# EAGLE schematic CAN_Node2pi (EAGLE 7.7.0)
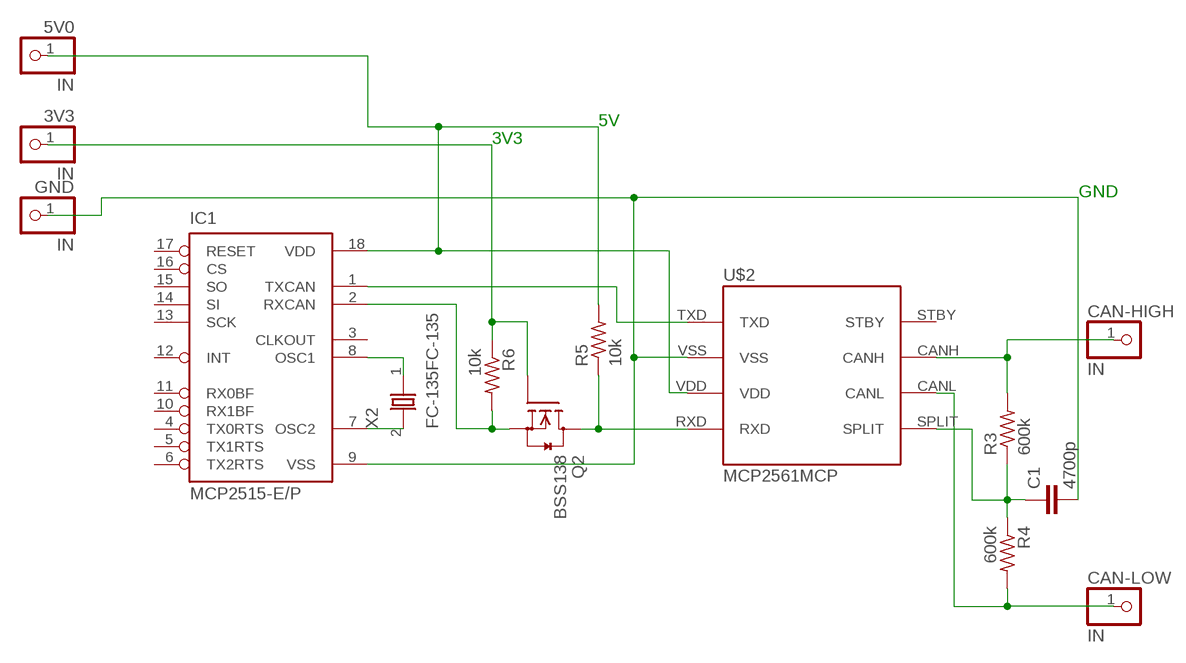
[diagram p0: schematic, sheet 1]

## Parts
3V3  IN  PINHD-1X1  [1X01]
5V0  IN  PINHD-1X1  [1X01]
C1  4700p  C2.5/2  [C2.5-2]
CAN-HIGH  IN  PINHD-1X1  [1X01]
CAN-LOW  IN  PINHD-1X1  [1X01]
GND  IN  PINHD-1X1  [1X01]
IC1  MCP2515-E/P  [DIL18]
Q2  BSS138  [SOT23]
R3  600k  R-US_M2309  [M2309]
R4  600k  R-US_M2309  [M2309]
R5  10k  R-US_M2309  [M2309]
R6  10k  R-US_M2309  [M2309]
U$2  MCP2561MCP  [MCP2561_PDIP]
X2  FC-135FC-135  [FC-135]

## Nets
N$3: 3V3.1 Q2.1(G) R6.1
N$5: C1.2 GND.1 IC1.9(VSS) U$2.VSS
N$7: C1.1 R3.1 R4.1 U$2.SPLIT
N$8: CAN-HIGH.1 R3.2 U$2.CANH
N$9: CAN-LOW.1 R4.2 U$2.CANL
N$10: IC1.2(RXCAN) Q2.2(S) R6.2
N$11: Q2.3(D) R5.1 U$2.RXD
N$12: IC1.7(OSC2) X2.2
N$13: IC1.8(OSC1) X2.1
N$15: 5V0.1 IC1.18(VDD) R5.2 U$2.VDD
N$16: IC1.1(TXCAN) U$2.TXD
Unconnected: IC1.3(CLKOUT) IC1.4(TX0RTS) IC1.5(TX1RTS) IC1.6(TX2RTS) IC1.10(RX1BF) IC1.11(RX0BF) IC1.12(INT) IC1.13(SCK) IC1.14(SI) IC1.15(SO) IC1.16(CS) IC1.17(RESET) U$2.STBY

## Notes on the sheet
- 5V
- 3V3
- GND

## Library data of the parts
3V3 5V0 CAN-HIGH CAN-LOW GND = pinhead:PINHD-1X1: PIN HEADER
C1 = capacitor-wima:C: CAPACITOR naming: grid - package width
IC1 = mcp2515:MCP2515
Q2 = m-pad-2.1:BSS138: Fairchild Semiconductors BSS138 N-Channel Logic Level Enhancement Mode Field Effect Transistor General Description: These N-Channel enhancement mode field effect transistors are produced using Fairchild's proprietary, high cell density, DMOS technology. These products have been designed to minimize on-state resistance while provide rugged, reliable, and fast switching performance.These products are particularly suited for low voltage, low current applications such as small servo motor control, power MOSFET gate drivers, and other switching applications. Features: 0.22 A, 50 V. RDS(ON) = 3.5Ohm @ VGS = 10 V RDS(ON) = 6.0Ohm @ VGS = 4.5 V High density cell design for extremely low RDS(ON) Rugged and Reliable Compact industry standard SOT-23 surface mount package Please send any comments to: messi@users.sourceforge.net
R3-R6 = rcl:R-US_: RESISTOR, American symbol
U$2 = mcp2561:MCP2561: High-Speed CAN Transceiver See http://ww1.microchip.com/downloads/en/DeviceDoc/25167A.pdf The MCP2561/2 is a Microchip Technology Inc. second generation high-speed CAN transceiver. It serves as an interface between a CAN protocol controller and the physical two-wire CAN bus. The device meets the automotive requirements for high-speed (up to 1 Mb/s), low quiescent current, electromagnetic compatibility (EMC) and electrostatic discharge (ESD).
X2 = m-pad-2.1:FC-135: Epson's FC-135 FC-145 Thin SMD High-Frequency Crystal unit High density mounting type SMD of 0.8mm Typ. thickness Excellent environmental capability Small packaging area and light weight Most suitable for small communication devices. Please send any comments to: messi@users.sourceforge.net